# Altium project MPPT.PrjPcb
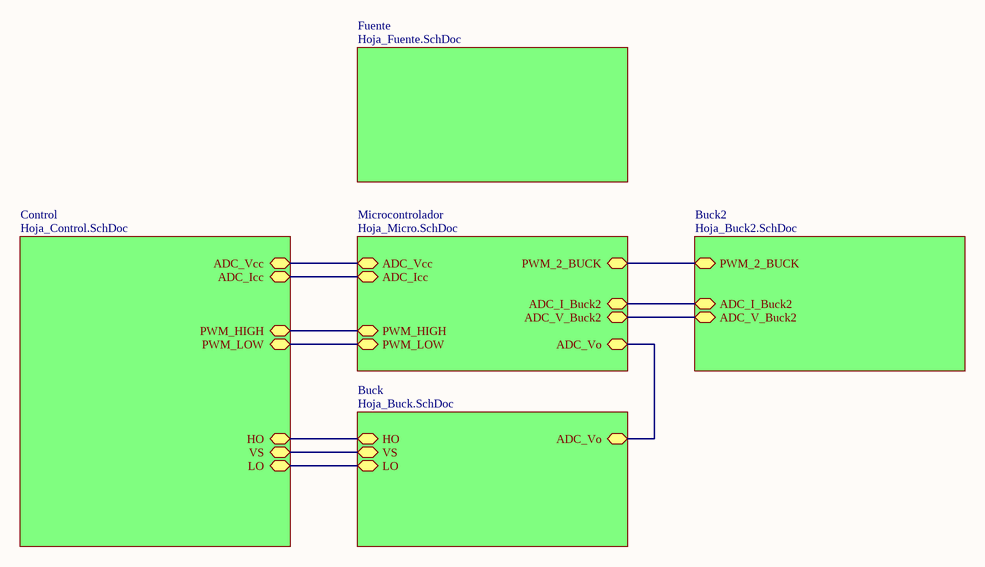
[diagram p0: Hoja_Master.SchDoc]
2 sheets, 12 parts. Net scope: hierarchical (ports join the sheet entries above them; power ports are global).
Board file: PCB_MPPT_v2.PcbDoc
Sheets:
  Hoja_Master.SchDoc
    Fuente = Hoja_Fuente.SchDoc

## Sheet Hoja_Master.SchDoc: Hoja_Master
size A4; SheetNumber: 1; SheetTotal: 6

### Sub-sheets
Buck = Hoja_Buck.SchDoc (file not in this document): HO (bidir), LO (bidir), VS (bidir), ADC_Vo (bidir)
Buck2 = Hoja_Buck2.SchDoc (file not in this document): ADC_I_Buck2 (bidir), ADC_V_Buck2 (bidir), PWM_2_BUCK (bidir)
Control = Hoja_Control.SchDoc (file not in this document): ADC_Vcc (bidir), ADC_Icc (bidir), PWM_HIGH (bidir), HO (bidir), LO (bidir), VS (bidir), PWM_LOW (bidir)
Fuente = Hoja_Fuente.SchDoc: no entries
Microcontrolador = Hoja_Micro.SchDoc (file not in this document): ADC_Vcc (bidir), ADC_Icc (bidir), PWM_HIGH (bidir), PWM_LOW (bidir), ADC_I_Buck2 (bidir), ADC_V_Buck2 (bidir), ADC_Vo (bidir), PWM_2_BUCK (bidir)

### Nets
(unnamed): sheet Microcontrolador/ADC_Vcc, sheet Control/ADC_Vcc
(unnamed): sheet Microcontrolador/ADC_Icc, sheet Control/ADC_Icc
(unnamed): sheet Microcontrolador/PWM_HIGH, sheet Control/PWM_HIGH
(unnamed): sheet Microcontrolador/PWM_LOW, sheet Control/PWM_LOW
(unnamed): sheet Microcontrolador/ADC_I_Buck2, sheet Buck2/ADC_I_Buck2
(unnamed): sheet Microcontrolador/ADC_V_Buck2, sheet Buck2/ADC_V_Buck2
(unnamed): sheet Microcontrolador/ADC_Vo, sheet Buck/ADC_Vo
(unnamed): sheet Microcontrolador/PWM_2_BUCK, sheet Buck2/PWM_2_BUCK
(unnamed): sheet Buck/HO, sheet Control/HO
(unnamed): sheet Buck/LO, sheet Control/LO
(unnamed): sheet Buck/VS, sheet Control/VS

### Notes on the sheet
- Title:
- Size:
- Author:
- A4
- Sheet
- of
- Revision:
- File:
- Date:

## Sheet Hoja_Fuente.SchDoc: Hoja_Fuente
size A4; SheetNumber: 2; SheetTotal: 6
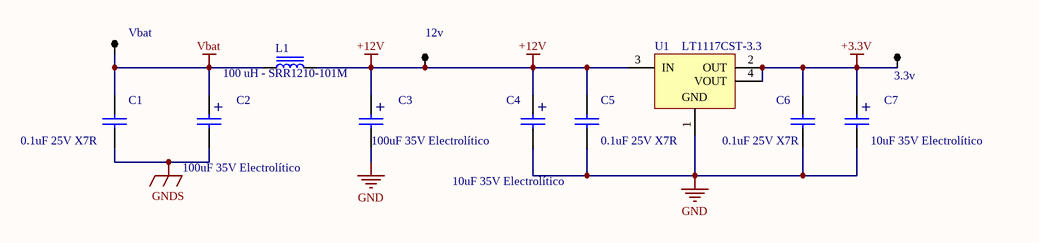
[diagram p1: Hoja_Fuente.SchDoc]

### Parts
3.3v  3.3v  [TPTH]
12v  12v  [TPTH]  (value not drawn)
C1  0.1uF 25V X7R  [0805]
C2  100uF 35V Electrolítico  [CAPSMD8x8.3]
C3  100uF 35V Electrolítico  [CAPSMD8x8.3]
C4  10uF 35V Electrolítico  [CAPSMD4.3x4.3]
C5  0.1uF 25V X7R  [0805]
C6  0.1uF 25V X7R  [0805]
C7  10uF 35V Electrolítico  [CAPSMD4.3x4.3]
L1  100 uH - SRR1210-101M  [SRR1210]
U1  LT1117CST-3.3  [SOT223]
Vbat  Vbat  [TPTH]  (value not drawn)

### Nets
+3.3V: 3.3v.1 C6.1 C7.1 U1.2(OUT) U1.4(VOUT)
+12V: 12v.1 C3.1 C4.1 C5.1 L1.2 U1.3(IN)
GND: C3.2 C4.2 C5.2 C6.2 C7.2 U1.1(GND)
GNDS: C1.2 C2.2
Vbat: C1.1 C2.1 L1.1 Vbat.1

### Notes on the sheet
- Title:
- Size:
- Author:
- A4
- Sheet
- of
- Revision:
- File:
- Date:
- (in symbol CAPPOL) +

### Library data of the parts
3.3v 12v Vbat = TP
C1 C5 C6 = CAP
C2 C3 = CAPPOL: Capacitores electrolíticos de aluminio 100 µF 35 V Radial, encapsulado - terminales SMD 1000 h a 105°C
C4 C7 = CAPPOL: Capacitores electrolíticos de aluminio 10 µF 35 V Radial, encapsulado - terminales SMD 2000 h a 105°C
L1 = INDUCTOR: SRR1210-101M - 100 µH Blindado Drum Core, Wirewound Inductivo 2.5 A 135mOhm máx. No estándar
U1 = LT1117CST-3.3: IC REG LINEAR 3.3V 800MA SOT223; Manufacturer: Linear Technology; Discrete Pass Element: no; Dropout Voltage(V): 1.1; Iout(mA): 800; Isupply(mA): 5; Number of Outputs: 1; PSRR(dB): 75; Vin Max(V): 15; Vin Min(V): 2.45; DatasheetVersion: Rev. D; PackageVersion: Jun-10; PackageReference: ST-3; PackageDescription: 3-Pin Plastic SOT-223, 3.505 x 6.505 mm Body, Pitch 2.3 mm; Supplier 1: Digi-Key; Supplier Part Number 1: LT1117CST-3.3-ND; Supplier 2: Newark; Supplier Part Number 2: 57M1797; Output Voltage: 3.3 V; RoHS: FALSE; Mounting Technology: Surface Mount; PartNumber: LT1117CST-3.3; ComponentLink1Description: Manufacturer URL; ComponentLink1URL: http://www.linear.com/; ComponentLink2Description: Datasheet; ComponentLink2URL: http://cds.linear.com/docs/en/datasheet/1117fd.pdf; ComponentLink3Description: Package Specification; ComponentLink3URL: http://cds.linear.com/docs/en/packaging/SOT_3_05-08-1630.pdf